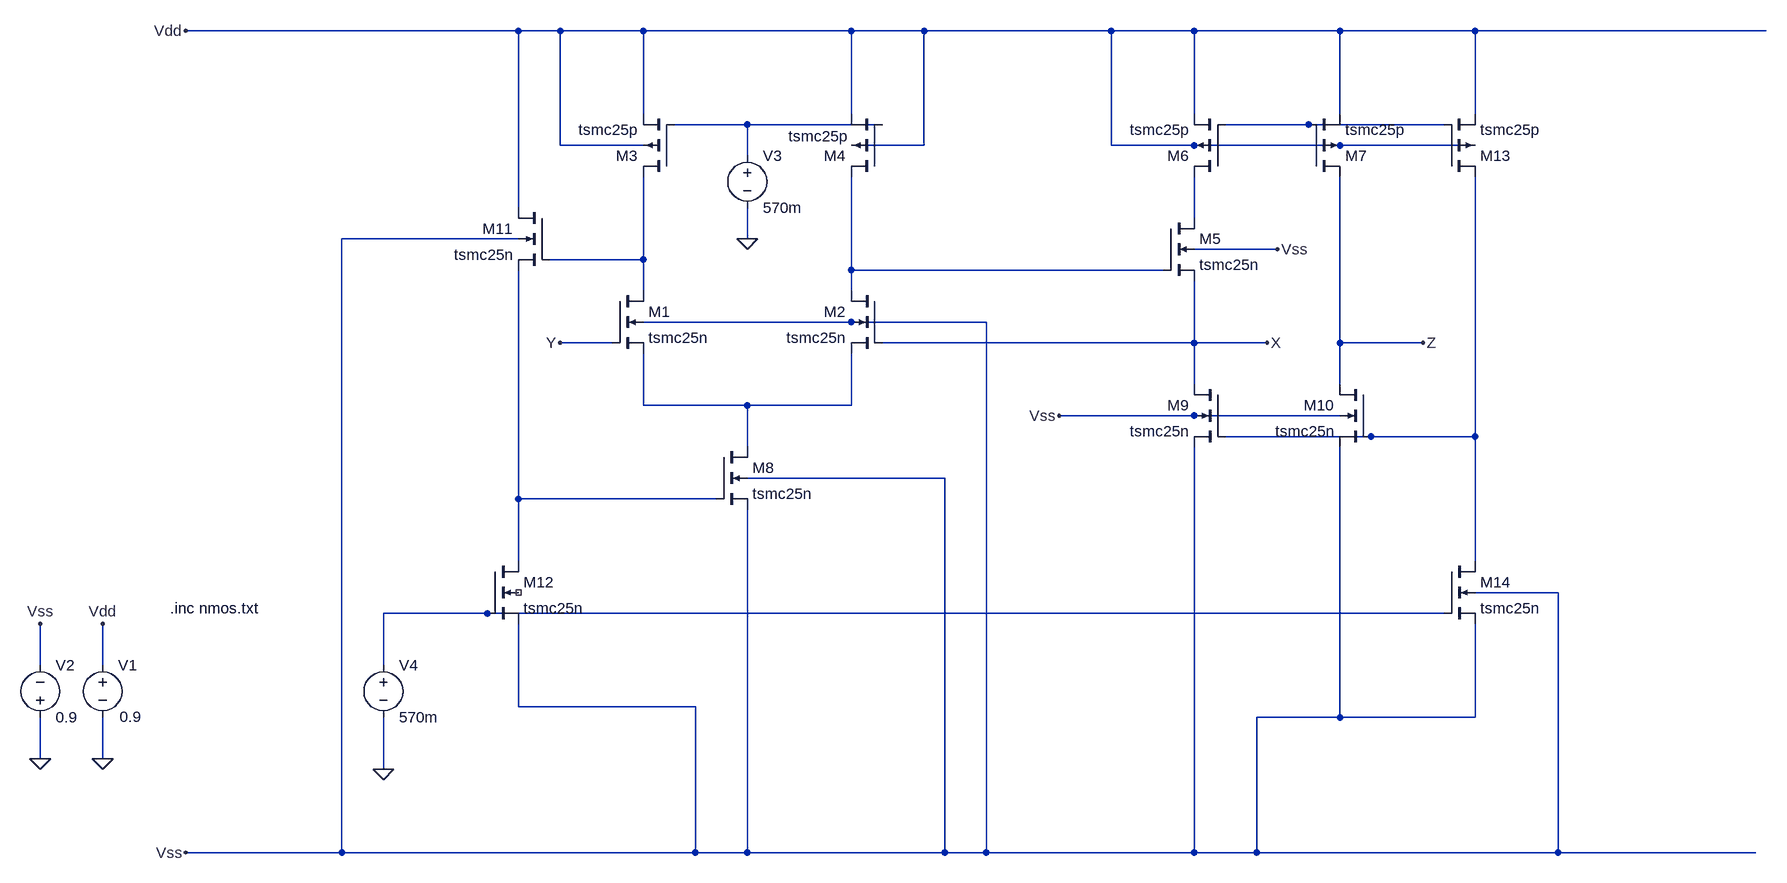
[diagram p0: schematic CCII_2.asc]
CCII_2.asc, the LTspice schematic file:
Version 4
SHEET 1 2612 1744
WIRE -256 400 -768 400
WIRE -192 400 -256 400
WIRE -64 400 -192 400
WIRE 256 400 -64 400
WIRE 368 400 256 400
WIRE 656 400 368 400
WIRE 784 400 656 400
WIRE 1008 400 784 400
WIRE 1216 400 1008 400
WIRE 1664 400 1216 400
WIRE -64 528 -64 400
WIRE 256 528 256 400
WIRE 784 528 784 400
WIRE 1008 528 1008 400
WIRE 1216 528 1216 400
WIRE 96 544 -16 544
WIRE 304 544 96 544
WIRE 960 544 832 544
WIRE 1168 544 960 544
WIRE -192 576 -192 400
WIRE -64 576 -192 576
WIRE 368 576 368 400
WIRE 368 576 256 576
WIRE 656 576 656 400
WIRE 784 576 656 576
WIRE 1008 576 784 576
WIRE 1216 576 1008 576
WIRE 96 592 96 544
WIRE -256 672 -256 400
WIRE 784 688 784 624
WIRE -256 720 -528 720
WIRE 96 720 96 672
WIRE 912 736 784 736
WIRE -64 752 -64 624
WIRE -64 752 -208 752
WIRE 256 768 256 624
WIRE 736 768 256 768
WIRE -64 800 -64 752
WIRE 256 800 256 768
WIRE 256 848 -64 848
WIRE 464 848 256 848
WIRE -112 880 -192 880
WIRE 784 880 784 784
WIRE 784 880 304 880
WIRE 896 880 784 880
WIRE 1008 880 1008 624
WIRE 1136 880 1008 880
WIRE 784 944 784 880
WIRE 1008 944 1008 880
WIRE -64 976 -64 896
WIRE 96 976 -64 976
WIRE 256 976 256 896
WIRE 256 976 96 976
WIRE 784 992 576 992
WIRE 1008 992 784 992
WIRE 1056 1024 832 1024
WIRE 1216 1024 1216 624
WIRE 1216 1024 1056 1024
WIRE 96 1040 96 976
WIRE 400 1088 96 1088
WIRE -256 1120 -256 768
WIRE 48 1120 -256 1120
WIRE -256 1216 -256 1120
WIRE 1216 1216 1216 1024
WIRE 1344 1264 1216 1264
WIRE -304 1296 -464 1296
WIRE 1168 1296 -304 1296
WIRE -992 1376 -992 1312
WIRE -896 1376 -896 1312
WIRE -464 1376 -464 1296
WIRE -256 1440 -256 1312
WIRE 16 1440 -256 1440
WIRE 1008 1456 1008 1040
WIRE 1008 1456 880 1456
WIRE 1216 1456 1216 1312
WIRE 1216 1456 1008 1456
WIRE -992 1520 -992 1456
WIRE -896 1520 -896 1456
WIRE -464 1536 -464 1456
WIRE -528 1664 -528 720
WIRE -528 1664 -768 1664
WIRE 16 1664 16 1440
WIRE 16 1664 -528 1664
WIRE 96 1664 96 1136
WIRE 96 1664 16 1664
WIRE 400 1664 400 1088
WIRE 400 1664 96 1664
WIRE 464 1664 464 848
WIRE 464 1664 400 1664
WIRE 784 1664 784 1040
WIRE 784 1664 464 1664
WIRE 880 1664 880 1456
WIRE 880 1664 784 1664
WIRE 1344 1664 1344 1264
WIRE 1344 1664 880 1664
WIRE 1648 1664 1344 1664
FLAG -992 1520 0
FLAG -896 1520 0
FLAG -992 1312 Vss
FLAG -896 1312 Vdd
FLAG -768 400 Vdd
FLAG -768 1664 Vss
FLAG -192 880 Y
FLAG 896 880 X
FLAG 1136 880 Z
FLAG 96 720 0
FLAG -464 1536 0
FLAG 912 736 Vss
FLAG 576 992 Vss
SYMBOL voltage -896 1360 R0
WINDOW 123 24 124 Left 2
WINDOW 39 0 0 Left 0
WINDOW 3 26 95 Left 2
SYMATTR Value 0.9
SYMATTR InstName V1
SYMBOL voltage -992 1472 M180
WINDOW 0 24 96 Left 2
WINDOW 3 24 16 Left 2
WINDOW 123 0 0 Left 0
WINDOW 39 0 0 Left 0
SYMATTR InstName V2
SYMATTR Value 0.9
SYMBOL pmos4 -16 624 R180
SYMATTR InstName M3
SYMATTR Value tsmc25p
SYMATTR Value2 l=2.5u w=10u
SYMBOL pmos4 304 624 R180
WINDOW 3 53 62 Left 2
SYMATTR Value tsmc25p
SYMATTR InstName M4
SYMATTR Value2 l=2.5u w=10u
SYMBOL pmos4 832 624 R180
SYMATTR InstName M6
SYMATTR Value tsmc25p
SYMATTR Value2 l=2.5u w=100u
SYMBOL pmos4 960 624 M180
SYMATTR InstName M7
SYMATTR Value tsmc25p
SYMATTR Value2 l=2.5u w=100u
SYMBOL pmos4 1168 624 M180
SYMATTR InstName M13
SYMATTR Value tsmc25p
SYMATTR Value2 l=2.5u w=2.5u
SYMBOL nmos4 -208 672 M0
SYMATTR InstName M11
SYMATTR Value tsmc25n
SYMATTR Value2 l=0.5u w=4u
SYMBOL nmos4 -112 800 R0
SYMATTR InstName M1
SYMATTR Value tsmc25n
SYMATTR Value2 l=1u w=60u
SYMBOL nmos4 304 800 M0
SYMATTR InstName M2
SYMATTR Value tsmc25n
SYMATTR Value2 l=1u w=60u
SYMBOL nmos4 48 1040 R0
SYMATTR InstName M8
SYMATTR Value tsmc25n
SYMATTR Value2 l=2.5u w=5u
SYMBOL nmos4 -304 1216 R0
SYMATTR InstName M12
SYMATTR Value tsmc25n
SYMATTR Value2 l=2.5u w=5u
SYMBOL nmos4 736 688 R0
SYMATTR InstName M5
SYMATTR Value tsmc25n
SYMATTR Value2 l=0.5u w=4u
SYMBOL nmos4 832 944 M0
SYMATTR InstName M9
SYMATTR Value tsmc25n
SYMATTR Value2 l=2.5u w=50u
SYMBOL nmos4 1056 944 M0
SYMATTR InstName M10
SYMATTR Value tsmc25n
SYMATTR Value2 l=2.5u w=50u
SYMBOL nmos4 1168 1216 R0
SYMATTR InstName M14
SYMATTR Value tsmc25n
SYMATTR Value2 l=2.5u w=10u
SYMBOL voltage 96 576 R0
WINDOW 123 0 0 Left 0
WINDOW 39 0 0 Left 0
SYMATTR InstName V3
SYMATTR Value 570m
SYMBOL voltage -464 1360 R0
WINDOW 123 0 0 Left 0
WINDOW 39 0 0 Left 0
SYMATTR InstName V4
SYMATTR Value 570m
TEXT -792 1288 Left 2 !.inc nmos.txt

The netlist it stands for:
* CCII_2.asc
V1 Vdd 0 0.9
V2 0 Vss 0.9
M3 N004 N001 Vdd Vdd tsmc25p l=2.5u w=10u
M4 N005 N001 Vdd Vdd tsmc25p l=2.5u w=10u
M6 N003 N002 Vdd Vdd tsmc25p l=2.5u w=100u
M7 Z N002 Vdd Vdd tsmc25p l=2.5u w=100u
M13 N007 N002 Vdd Vdd tsmc25p l=2.5u w=2.5u
M11 Vdd N004 N008 Vss tsmc25n l=0.5u w=4u
M1 N004 Y N006 Vss tsmc25n l=1u w=60u
M2 N005 X N006 Vss tsmc25n l=1u w=60u
M8 N006 N008 Vss Vss tsmc25n l=2.5u w=5u
M12 N008 N009 Vss NC_01 tsmc25n l=2.5u w=5u
M5 N003 N005 X Vss tsmc25n l=0.5u w=4u
M9 X N007 Vss Vss tsmc25n l=2.5u w=50u
M10 Z N007 Vss Vss tsmc25n l=2.5u w=50u
M14 N007 N009 Vss Vss tsmc25n l=2.5u w=10u
V3 N001 0 570m
V4 N009 0 570m
.model NMOS NMOS
.model PMOS PMOS
.lib standard.mos
.inc nmos.txt
.backanno
.end